# EAGLE design amg8833 (EAGLE 9.1.0)
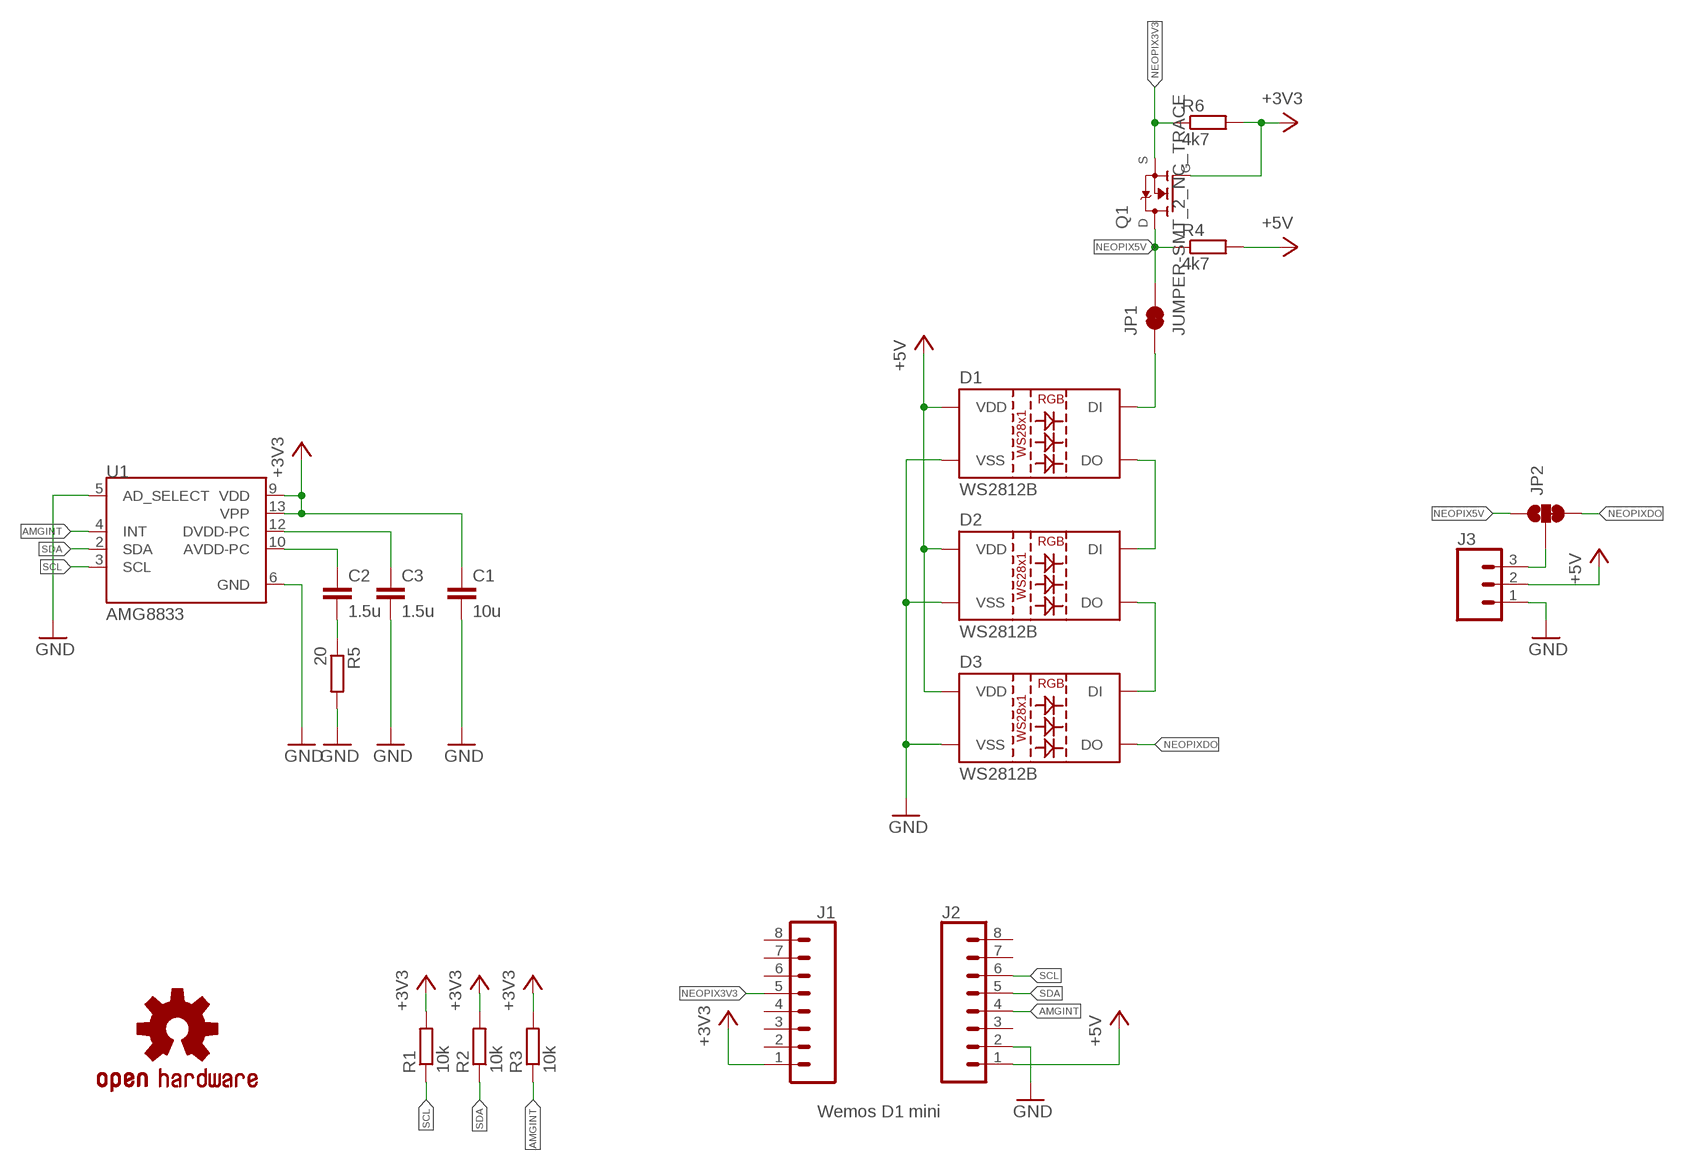
[diagram p0: schematic, sheet 1]

## Parts
C1  10u  C-EUC0603  [C0603]
C2  1.5u  C-EUC0603  [C0603]
C3  1.5u  C-EUC0603  [C0603]
D1  WS2812B  [WS2812B]
D2  WS2812B  [WS2812B]
D3  WS2812B  [WS2812B]
J1  CONN_08  [1X08_LOCK_NO_SILK]
J2  CONN_08  [1X08_LOCK_NO_SILK]
J3  CONN_03SCREWTERMINAL-3.5MM-3-NS  [SCREWTERMINAL-3.5MM-3-NS]
JP1  JUMPER-SMT_2_NC_TRACE  [SMT-JUMPER_2_NC_TRACE_SILK]
JP2  JUMPER-SMT_3_1-NC_TRACE  [SMT-JUMPER_3_1-NC_TRACE_SILK]
LOGO1  OSHW-LOGO  [OSHW-LOGO-M]
Q1  BSN20,215  [BSN20_215]
R1  10k  R-EU_R0603  [R0603]
R2  10k  R-EU_R0603  [R0603]
R3  10k  R-EU_R0603  [R0603]
R4  4k7  R-EU_R0603  [R0603]
R5  20  R-EU_R0603  [R0603]
R6  4k7  R-EU_R0603  [R0603]
U1  AMG8833  [XDCR_AMG8833]

## Nets
+3V3: C1.1 J1.1 Q1.1(G) R1.2 R2.2 R3.2 R6.2 U1.9(VDD) U1.13(VPP)
+5V: D1.1(VDD) D2.1(VDD) D3.1(VDD) J2.1 J3.2 R4.2
AMGINT: J2.4 R3.1 U1.4(INT)
GND: C1.2 C3.2 D1.3(VSS) D2.3(VSS) D3.3(VSS) J2.2 J3.1 R5.2 U1.5(AD_SELECT) U1.6(GND)
MEOPIXOUT: J3.3 JP2.2
N$1: C3.1 U1.12(DVDD-PC)
N$2: C2.1 U1.10(AVDD-PC)
N$3: D1.2(DO) D2.4(DI)
N$4: D2.2(DO) D3.4(DI)
N$5: D1.4(DI) JP1.1
N$6: C2.2 R5.1
NEOPIX3V3: J1.5 Q1.2(S) R6.1
NEOPIX5V: JP1.2 JP2.1 Q1.3(D) R4.1
NEOPIXDO: D3.2(DO) JP2.3
SCL: J2.6 R1.1 U1.3(SCL)
SDA: J2.5 R2.1 U1.2(SDA)
Unconnected: J1.2 J1.3 J1.4 J1.6 J1.7 J1.8 J2.3 J2.7 J2.8

## Notes on the sheet
- Wemos D1 mini

## Library data of the parts
C1-C3 = rcl:C-EU: CAPACITOR, European symbol; SPICEPREFIX: C
D1-D3 = jonas_SparkFun-LED:WS2812B
J1 J2 = jonas_Sparkfun-Connectors:CONN_08
J3 = jonas_Sparkfun-Connectors:CONN_03
JP1 = jonas_SparkFun_Jumper:JUMPER-SMT_2_NC_TRACE
JP2 = jonas_SparkFun_Jumper:JUMPER-SMT_3_1-NC_TRACE
LOGO1 = jonas_SparkFun-Aesthetics:OSHW-LOGO
Q1 = jonas_mosfet:BSN20,215: BSN20 N chan with source-drain diode handy for I2C voltage shifter; AVAILABILITY: Good; DESCRIPTION: BSN Series 50 V 15 Ohm 0.83 W N-Channel Enhancement Mode Transistor - SOT-23; MF: NXP Semiconductors; MP: BSN20,215; PACKAGE: TO-236 NXP Semiconductors; PRICE: 0.17 USD
R1-R6 = rcl:R-EU_: RESISTOR, European symbol; SPICEPREFIX: R
U1 = AMG8833:AMG8833: Amg88xx Sensor Grid-Eye 3.3v 8.0x11.6x4.3 Hgh Gain Gen2; DESCRIPTION: Amg88xx Sensor Grid-Eye 3.3v 8.0x11.6x4.3 Hgh Gain Gen2; DIGI-KEY_PART_NUMBER: P19002CT-ND; DIGI-KEY_PURCHASE_URL: https://www.digikey.fr/product-detail/en/panasonic-electronic-components/AMG8833/P19002CT-ND/5825306?utm_source=snapeda&utm_medium=aggregator&utm_campaign=symbol; MF: Panasonic; MP: AMG8833; PACKAGE: SMD-14 Panasonic

## Net classes
3 SIGNAL: width 0.203 mm

## Board
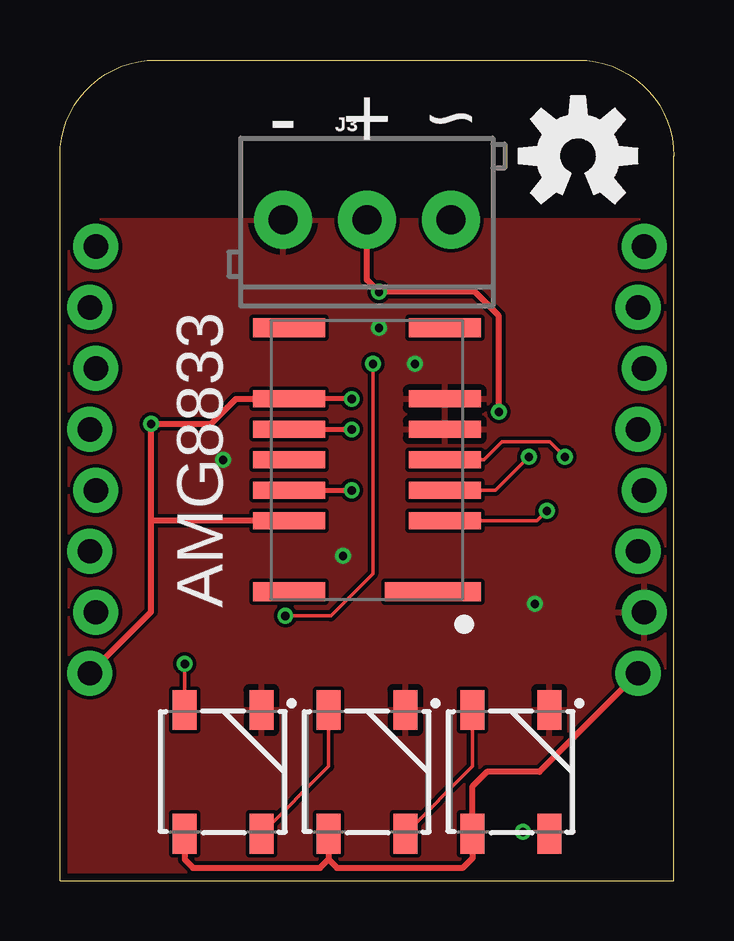
[diagram p1: board, top side]
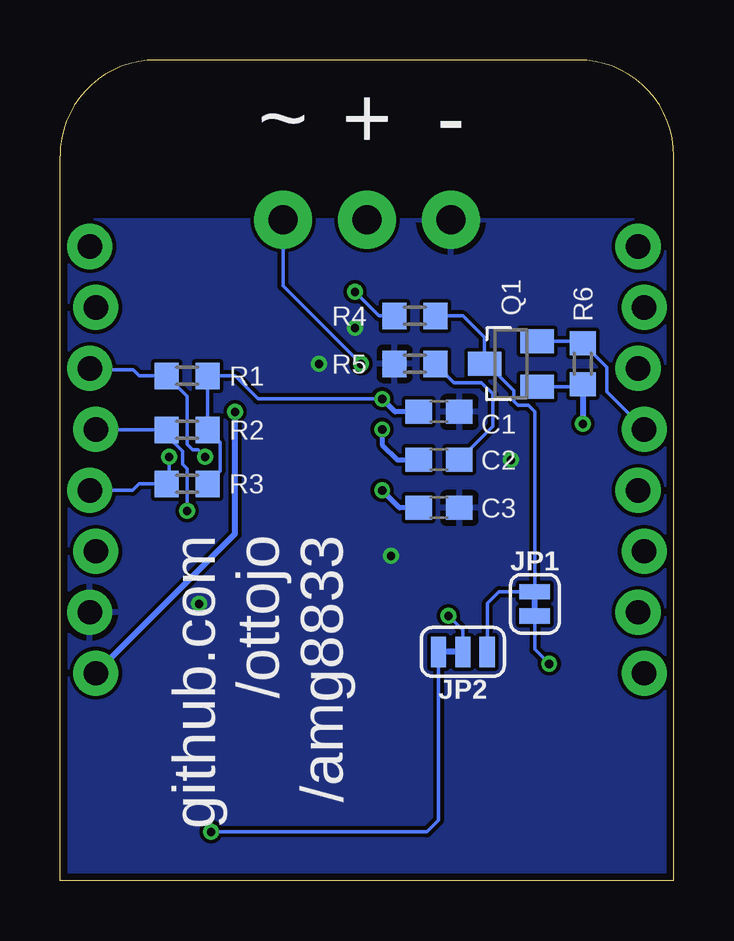
[diagram p2: board, bottom side, seen from below]

Size 25.6 x 34.2 mm. Coordinates in mm from the lower left corner, seen from the top.
Outline: 0,0 25.6,0 25.6,30.2 arc90 21.6,34.2 4,34.2 arc90 0,30.2 0,0
Copper layers (1*16): Top 0.035mm / dielectric 1.5mm / Bottom 0.035mm
Design rules "default *": minimum track width 6mil, minimum drill 0.3mm, track to track 6mil, track to pad 8mil, pad to pad 6mil, via to via 6mil, smd to smd 6mil, copper to edge 0.3mm, drill to drill 12mil, minimum pad ring 6mil, minimum via ring 6mil, stop-mask expansion 4mil, vias tented up to drill 0.45mm, thermal gap 10mil

### Footprints (pad centres in the part's own frame; a part is rotated, then mirrored left to right if it is on the bottom)
C0603 = smd 1.1 x 1: 1 -0.85,0; 2 0.85,0
WS2812B = smd 1.651 x 1: 1 2.577,-1.6; 2 2.577,1.6; 3 -2.577,1.6; 4 -2.577,-1.6
1X08_LOCK_NO_SILK = drill 1.016 pad 1.88: 1 0,0.127; 2 2.54,-0.127; 3 5.08,0.127; 4 7.62,-0.127; 5 10.16,0.127; 6 12.7,-0.127; 7 15.24,0.127; 8 17.78,-0.127
SCREWTERMINAL-3.5MM-3-NS = drill 1.2 pad 2.413: 1 0,0; 2 3.5,0; 3 7,0
SMT-JUMPER_2_NC_TRACE_SILK = smd 0.635 x 1.27: 1 -0.508,0; 2 0.508,0
SMT-JUMPER_3_1-NC_TRACE_SILK = smd 0.635 x 1.27: 1 -1.016,0; 2 0,0; 3 1.016,0
BSN20_215 = smd 1 x 1.4: 1 -0.95,-1.1; 2 0.95,-1.1; 3 0,1.1
R0603 = smd 1 x 1.1: 1 -0.85,0; 2 0.85,0
XDCR_AMG8833 = smd 0.8 x 4: 1 -5.5,-2.75 | smd 0.7 x 3: 2 -2.54,-3.25; 3 -1.27,-3.25; 4 0,-3.25; 5 1.27,-3.25; 6 2.54,-3.25; 9 2.54,3.25; 10 1.27,3.25; 11 0,3.25; 12 -1.27,3.25; 13 -2.54,3.25 | smd 0.8 x 3: 7 5.5,-3.25; 8 5.5,3.25; 14 -5.5,3.25

### Placement (x,y rotation side)
C1  9.8,19.54 0 bottom
C2  9.8,17.54 0 bottom
C3  9.8,15.54 0 bottom
D1  6.8,4.54 270 top
D2  12.8,4.54 270 top
D3  18.8,4.54 270 top
J1  1.37,8.65 90 top
J2  24.23,8.65 90 top
J3  9.3,27.54 0 top
JP1  5.8,11.54 90 bottom
JP2  8.8,9.54 180 bottom
LOGO1  21.6,30.2 0 top
Q1  6.8,21.54 90 bottom
R1  20.3,21.04 0 bottom
R2  20.3,18.79 0 bottom
R3  20.3,16.54 0 bottom
R4  10.8,23.54 180 bottom
R5  10.8,21.54 180 bottom
R6  3.8,21.54 270 bottom
U1  12.8,17.54 90 top

### Tracks (layer width: path | path; a pad name or v marks a point on that pad's centre or on a via)
+3V3  (via drill 0.35)
  Top 0.203: v12.17,20.08 U1.9
  Top 0.254: J1.1 3.8,11.21 3.8,15.04 | 3.8,15.04 v3.8,19.04 6.3,19.04 7.34,20.08 U1.9 | U1.13 3.84,15 3.8,15.04
  Bottom 0.152: Q1.1 3.9,20.59 R6.2 | v12.17,20.08 17.34,20.08 18.3,21.04 R1.2 R2.2 18.93,18.27 18.93,17.06 R3.2
  Bottom 0.203: C1.1 11.62,19.54 v12.17,20.08
  Bottom 0.254: R6.2 v3.8,19.04
+5V  (via drill 0.35)
  Top 0.254: D1.1 5.2,0.89 5.55,0.54 10.85,0.54 11.2,0.89 | D2.1 11.2,0.89 | 11.2,0.89 11.55,0.54 16.8,0.54 17.2,0.94 D3.1 17.2,3.94 17.8,4.54 19.99,4.54 J2.1 | v18.3,19.54 18.3,23.54 17.3,24.54 v13.3,24.54 12.8,25.04 J3.2
  Bottom 0.152: R4.2 12.3,23.54 v13.3,24.54
  Bottom 0.254: J2.1 18.3,14.45 18.3,18.54 v18.3,19.54
AMGINT  (via drill 0.35)
  Top 0.152: U1.4 17.68,17.54 17.74,17.6 18.3,18.16 18.43,18.29 20.43,18.29 20.55,18.16 20.61,18.1 v21.05,17.66
  Bottom 0.152: v21.05,17.66 21.05,16.64 R3.1 22.3,16.54 22.57,16.27 J2.4
GND  (via drill 0.35)
  other vias: 19.8,11.54 11.8,13.54 14.8,21.54 13.3,23.04 6.8,17.54
  pour Top (rank 6): -1.2,27.54 -1.2,-1.46 26.8,-1.46 26.8,27.54
  pour Bottom (rank 6): -2.2,27.54 -2.2,-2.46 27.8,-2.46 27.8,27.54
MEOPIXOUT  (via drill 0.35)
  Top 0.152: v9.4,11.04 11.3,11.04 13.05,12.79 v13.05,21.54
  Bottom 0.152: JP2.2 8.8,10.44 v9.4,11.04 | v13.05,21.54 16.3,24.79 J3.3
N$1  (via drill 0.35)
  Top 0.203: U1.12 v12.17,16.27
  Bottom 0.203: C3.1 11.44,15.54 v12.17,16.27
N$2  (via drill 0.35)
  Top 0.203: U1.10 v12.17,18.81
  Bottom 0.203: v12.17,18.81 12.17,18.18 11.53,17.54 C2.1
N$3
  Top 0.152: D1.2 11.2,4.76 D2.4
N$4
  Top 0.152: D2.2 17.2,4.76 D3.4
N$5  (via drill 0.35)
  Top 0.152: v5.2,9.04 D1.4
  Bottom 0.152: JP1.1 5.8,9.64 v5.2,9.04
N$6
  Bottom 0.152: 9.55,21.54 R5.1 9.17,20.76 8.02,20.76 7.55,20.29 7.55,18.94 C2.2
NEOPIX3V3
  Bottom 0.152: Q1.2 3.9,22.49 3.88,22.46 R6.1 2.8,21.39 2.8,20.37 J1.5
NEOPIX5V
  Bottom 0.152: R4.1 8.8,23.54 7.9,22.64 Q1.3 7.8,21.54 6.68,20.42 6.68,19.97 6.52,19.81 6.07,19.81 5.8,19.54 JP1.2 7.29,12.05 7.78,11.56 JP2.1
NEOPIXDO  (via drill 0.35)
  Top 0.152: D3.2 20.32,2.04 v19.3,2.04
  Bottom 0.152: JP2.3 9.82,2.52 10.3,2.04 v19.3,2.04
SCL  (via drill 0.35)
  Top 0.152: U1.3 18.16,16.27 v19.55,17.66
  Bottom 0.152: J2.6 24.3,21.29 22.55,21.29 22.3,21.04 R1.1 20.3,20.19 20.3,18.2 20.07,17.96 19.85,17.96 v19.55,17.66
SDA  (via drill 0.35)
  Top 0.152: U1.2 19.89,15 v20.3,15.41
  Bottom 0.152: v20.3,15.41 20.3,17.16 20.49,17.36 20.49,17.89 21.15,18.55 R2.1 24.08,18.79 J2.5

### Text on the board
tPlace: - | + | ~ | AMG8833
bPlace: - | + | ~ | github.com / /ottojo / /amg8833